# EAGLE design T412_finalproj (EAGLE 9.6.2)
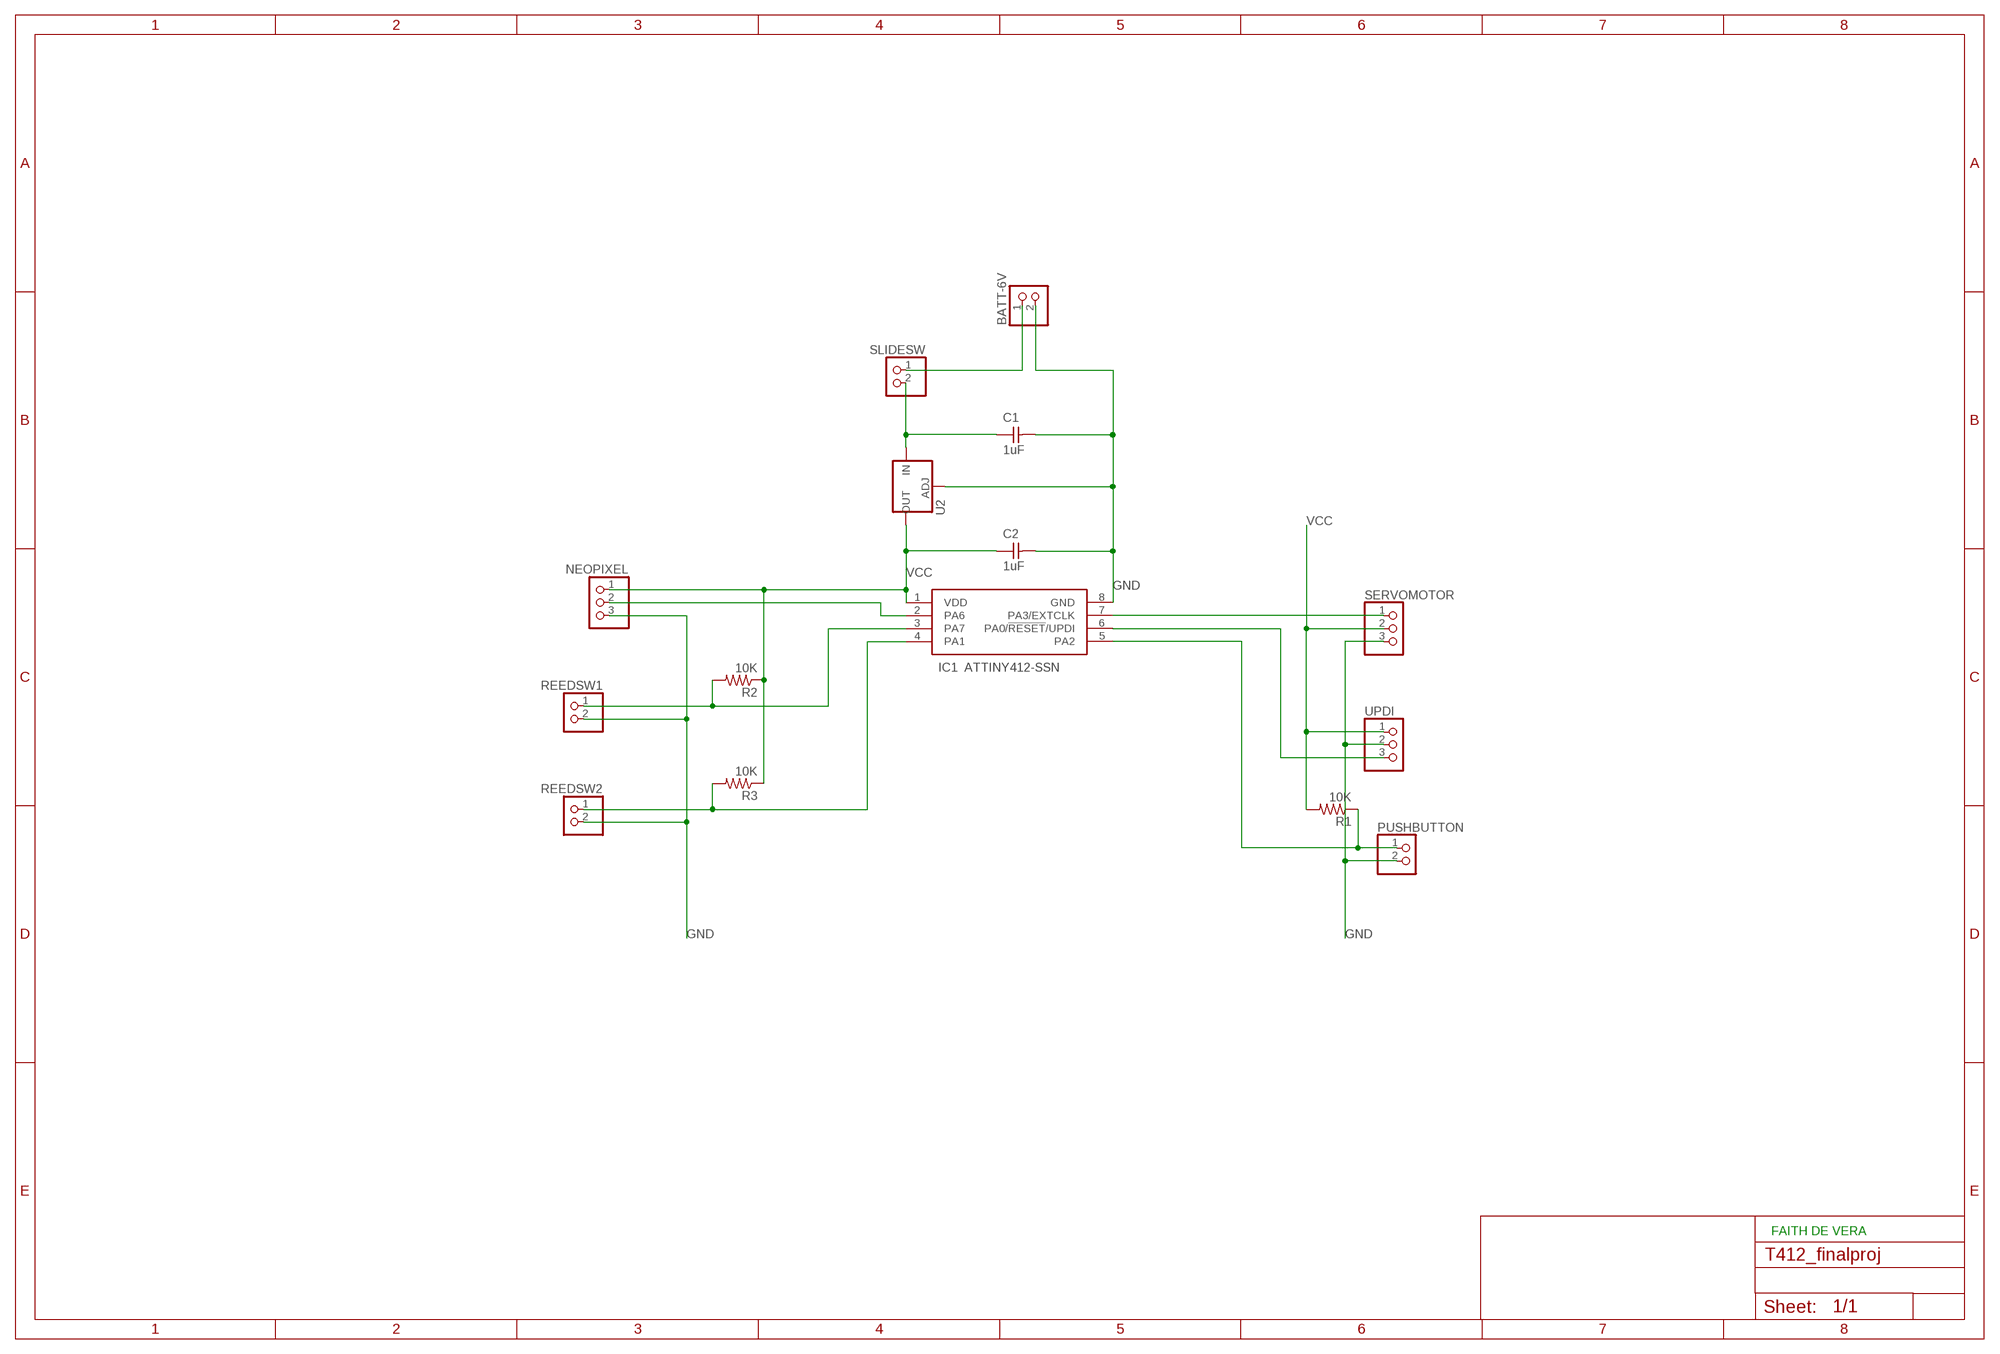
[diagram p0: schematic, sheet 1]

## Parts
BATT-6V  PINHD-1X2  [1X02]
C1  1uF  CAP_UNPOLARIZEDFAB  [C1206FAB]
C2  1uF  CAP_UNPOLARIZEDFAB  [C1206FAB]
IC1  ATTINY412-SSN  [SOIC127P600X175-8N]
NEOPIXEL  PINHD-1X3  [1X03]
PUSHBUTTON  PINHD-1X2  [1X02]
R1  10K  R1206FAB  [R1206FAB]
R2  10K  R1206FAB  [R1206FAB]
R3  10K  R1206FAB  [R1206FAB]
REEDSW1  PINHD-1X2  [1X02]
REEDSW2  PINHD-1X2  [1X02]
SERVOMOTOR  PINHD-1X3  [1X03]
SLIDESW  PINHD-1X2  [1X02]
U2  V_REG_LM1117SOT223  [SOT223]
UPDI  PINHD-1X3  [1X03]

## Nets
GND: BATT-6V.2 C1.2 C2.2 IC1.8(GND) NEOPIXEL.3 PUSHBUTTON.2 REEDSW1.2 REEDSW2.2 SERVOMOTOR.3 U2.1(ADJ) UPDI.2
N$1: IC1.5(PA2) PUSHBUTTON.1 R1.1
N$2: IC1.3(PA7) R2.2 REEDSW1.1
N$3: IC1.4(PA1) R3.2 REEDSW2.1
N$4: IC1.7(PA3/EXTCLK) SERVOMOTOR.1
N$5: IC1.6(PA0/!RESET!/UPDI) UPDI.3
N$6: C1.1 SLIDESW.2 U2.3(IN)
N$7: BATT-6V.1 SLIDESW.1
N$9: IC1.2(PA6) NEOPIXEL.2
VCC: C2.1 IC1.1(VDD) NEOPIXEL.1 R1.2 R2.1 R3.1 SERVOMOTOR.2 U2.2(OUT) U2.4(OUT) UPDI.1

## Notes on the sheet
- FAITH DE VERA

## Library data of the parts
BATT-6V PUSHBUTTON REEDSW1 REEDSW2 SLIDESW = pinhead+:PINHD-1X2: PIN HEADER
C1 C2 = fab:CAP_UNPOLARIZED
IC1 = ATTINY412-SSN:ATTINY412-SSN: 8-bit Microcontrollers - MCU 20MHz, 4KB, SOIC8, Ind 105C, Green, Tube Source: Datasheet <http://www.microchip.com/mymicrochip/filehandler.aspx?ddocname=en599382>; DESCRIPTION: 8-bit Microcontrollers - MCU 20MHz, 4KB, SOIC8, Ind 105C, Green, Tube; HEIGHT: 1.75mm; MANUFACTURER_NAME: Microchip; MANUFACTURER_PART_NUMBER: ATTINY412-SSN; MOUSER_PART_NUMBER: 579-ATTINY412-SSN; MOUSER_PRICE-STOCK: https://www.mouser.co.uk/ProductDetail/Microchip-Technology/ATTINY412-SSN?qs=3HJ2avRr9PItQG9ZsCamPQ%3D%3D
NEOPIXEL SERVOMOTOR UPDI = pinhead+:PINHD-1X3: PIN HEADER
R1-R3 = fab:R: Resistor (US Symbol) Variants with postfix FAB are widened to allow the routing of internal traces
U2 = SparkFun-IC-Power:V_REG_LM1117: Voltage Regulator LM1117 Standard adjustable voltage regulator but in SMD form. Spark Fun Electronics SKU : COM-00595; PROD_ID: VREG-08170

## Board
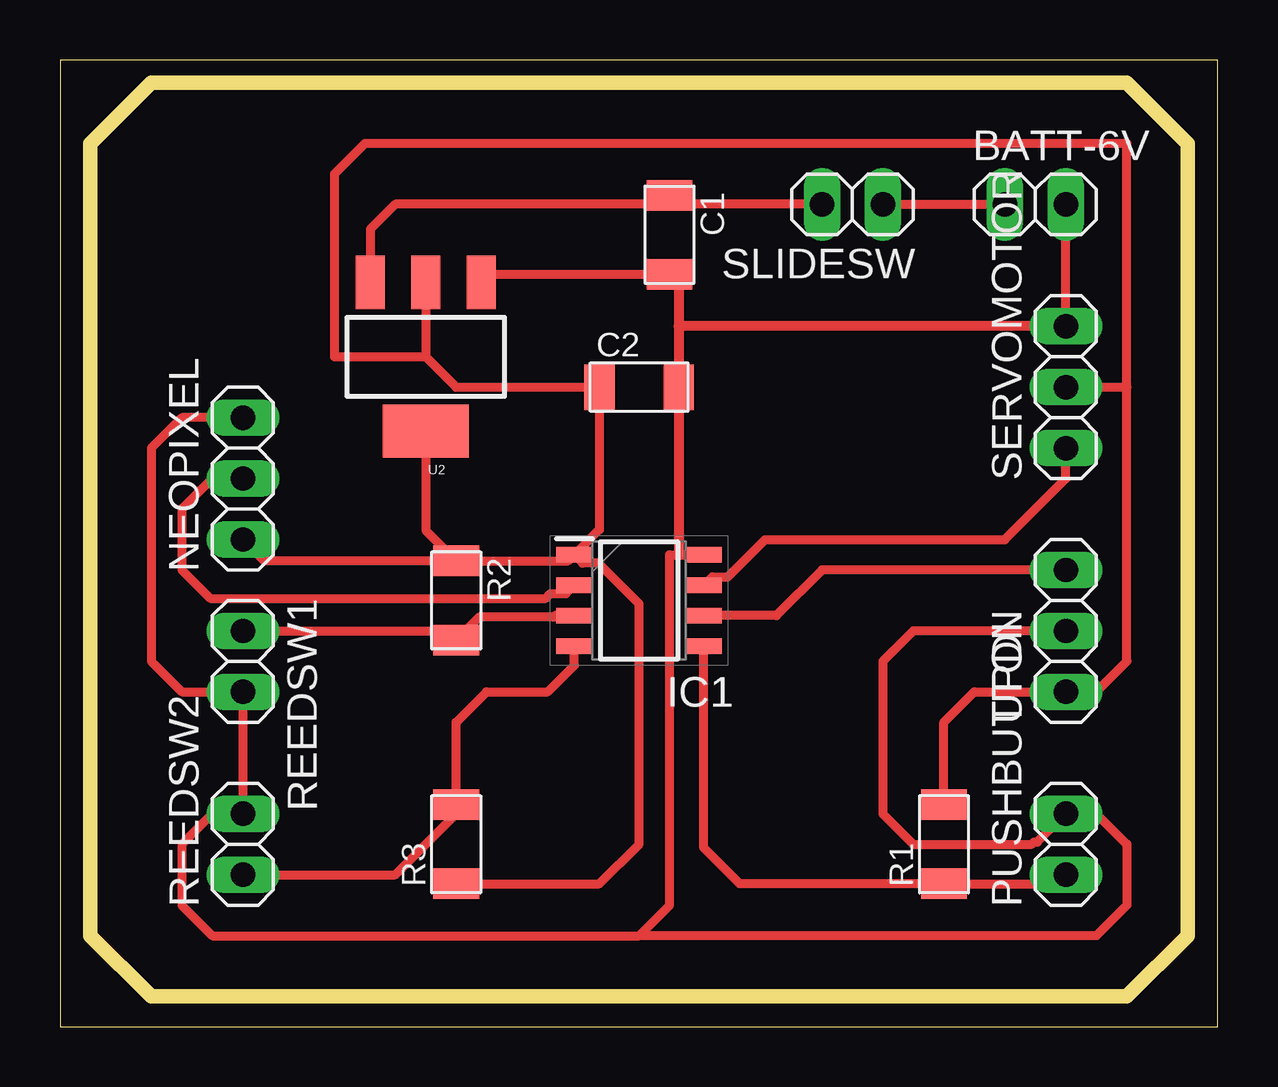
[diagram p1: board, top side]

Size 48.24 x 40.31 mm. Coordinates in mm from the lower left corner, seen from the top.
Outline: 0,0 48.24,0 48.24,40.31 0,40.31 0,0
Copper layers (1*16): Top 0.035mm / dielectric 1.5mm / Bottom 0.035mm
Design rules "default *": minimum track width 15mil, minimum drill 0.35mm, track to track 16mil, track to pad 16mil, pad to pad 16mil, via to via 16mil, smd to smd 12mil, copper to edge 40mil, drill to drill 6mil, minimum pad ring 10mil, minimum via ring 8mil, stop-mask expansion 4mil, vias tented up to drill 0mil, thermal gap 10mil
Milling: 8 lines

### Footprints (pad centres in the part's own frame; a part is rotated, then mirrored left to right if it is on the bottom)
1X02 = drill 1.016 long: 1 -1.27,0; 2 1.27,0
C1206FAB = smd 1.27 x 1.905: 1 -1.651,0; 2 1.651,0
SOIC127P600X175-8N = smd 1.5 x 0.65: 1 -2.7,1.905; 2 -2.7,0.635; 3 -2.7,-0.635; 4 -2.7,-1.905; 5 2.7,-1.905; 6 2.7,-0.635; 7 2.7,0.635; 8 2.7,1.905
1X03 = drill 1.016 long: 1 -2.54,0; 2 0,0; 3 2.54,0
R1206FAB = smd 1.27 x 1.905: 1 -1.651,0; 2 1.651,0
SOT223 = smd 1.219 x 2.235: 1 -2.311,-3.099; 2 0,-3.099; 3 2.311,-3.099 | smd 3.6 x 2.2: 4 0,3.099

### Placement (x,y rotation side)
BATT-6V  40.64,34.29 0 top
C1  25.4,33.02 270 top
C2  24.13,26.67 0 top
IC1  24.13,17.78 0 top
NEOPIXEL  7.62,22.86 90 top
PUSHBUTTON  41.91,7.62 90 top
R1  36.83,7.62 90 top
R2  16.51,17.78 270 top
R3  16.51,7.62 90 top
REEDSW1  7.62,15.24 270 top
REEDSW2  7.62,7.62 90 top
SERVOMOTOR  41.91,26.67 90 top
SLIDESW  33.02,34.29 180 top
U2  15.24,27.94 180 top
UPDI  41.91,16.51 90 top

### Tracks (layer width: path | path; a pad name or v marks a point on that pad's centre or on a via)
GND
  Top 0.381: 24.13,3.81 6.35,3.81 5.08,5.08 5.08,7.62 6.35,8.89 REEDSW2.2 REEDSW1.2 5.08,13.97 3.81,15.24 3.81,24.13 5.08,25.4 NEOPIXEL.3 | 24.13,3.81 25.4,5.08 25.4,19.68 25.78,19.68 26.04,19.68 IC1.8 | SERVOMOTOR.3 BATT-6V.2 | 26.23,27.11 C2.2 | UPDI.2 35.56,16.51 34.29,15.24 34.29,8.89 35.56,7.62 40.5,7.62 40.59,7.71 40.73,7.71 PUSHBUTTON.2 43.18,8.89 44.45,7.62 44.45,5.08 43.18,3.81 24.13,3.81 | C1.2 17.88,31.37 U2.1
  Top 0.406: C1.2 25.78,30.99 C2.2 | C2.2 25.78,19.68 | SERVOMOTOR.3 25.78,29.21 C2.2
N$1
  Top 0.381: PUSHBUTTON.1 41.53,5.97 R1.1 28.32,5.97 26.83,7.46 IC1.5
N$2
  Top 0.381: REEDSW1.1 16.13,16.51 R2.2 17.46,17.08 20.56,17.08 20.62,17.14 IC1.3
N$3
  Top 0.381: REEDSW2.1 13.97,6.35 16.51,8.89 R3.2 16.51,12.7 17.78,13.97 20.32,13.97 21.43,15.08 IC1.4
N$4
  Top 0.381: IC1.7 27.18,18.76 27.83,18.76 29.38,20.32 39.37,20.32 41.91,22.86 SERVOMOTOR.1
N$5
  Top 0.381: UPDI.3 31.75,19.05 29.84,17.14 IC1.6
N$6
  Top 0.381: U2.3 12.93,33.25 13.97,34.29 25.02,34.29 C1.1 25.78,34.29 SLIDESW.2
N$7
  Top 0.381: SLIDESW.1 BATT-6V.1
N$9
  Top 0.381: NEOPIXEL.2 6.35,22.86 5.08,21.59 5.08,19.05 6.26,17.87 20.23,17.87 20.43,18.07 21.08,18.07 IC1.2
VCC
  Top 0.381: R3.1 22.48,5.97 24.13,7.62 24.13,17.63 22.43,19.34 21.78,19.34 IC1.1 | R2.1 8.51,19.43 NEOPIXEL.1 | R2.1 21.18,19.43 IC1.1 | U2.2 15.24,27.94 | 15.24,27.94 16.51,26.67 C2.1 22.48,20.73 IC1.1 | R1.2 36.83,12.7 38.1,13.97 UPDI.1 43.18,13.97 44.45,15.24 44.45,26.67 | SERVOMOTOR.2 44.45,26.67 | 44.45,26.67 44.45,36.83 12.7,36.83 11.43,35.56 11.43,27.94 15.24,27.94 | U2.4 15.24,20.7 R2.1